# Altium schematic sheet Ventilator.SchDoc
size A3
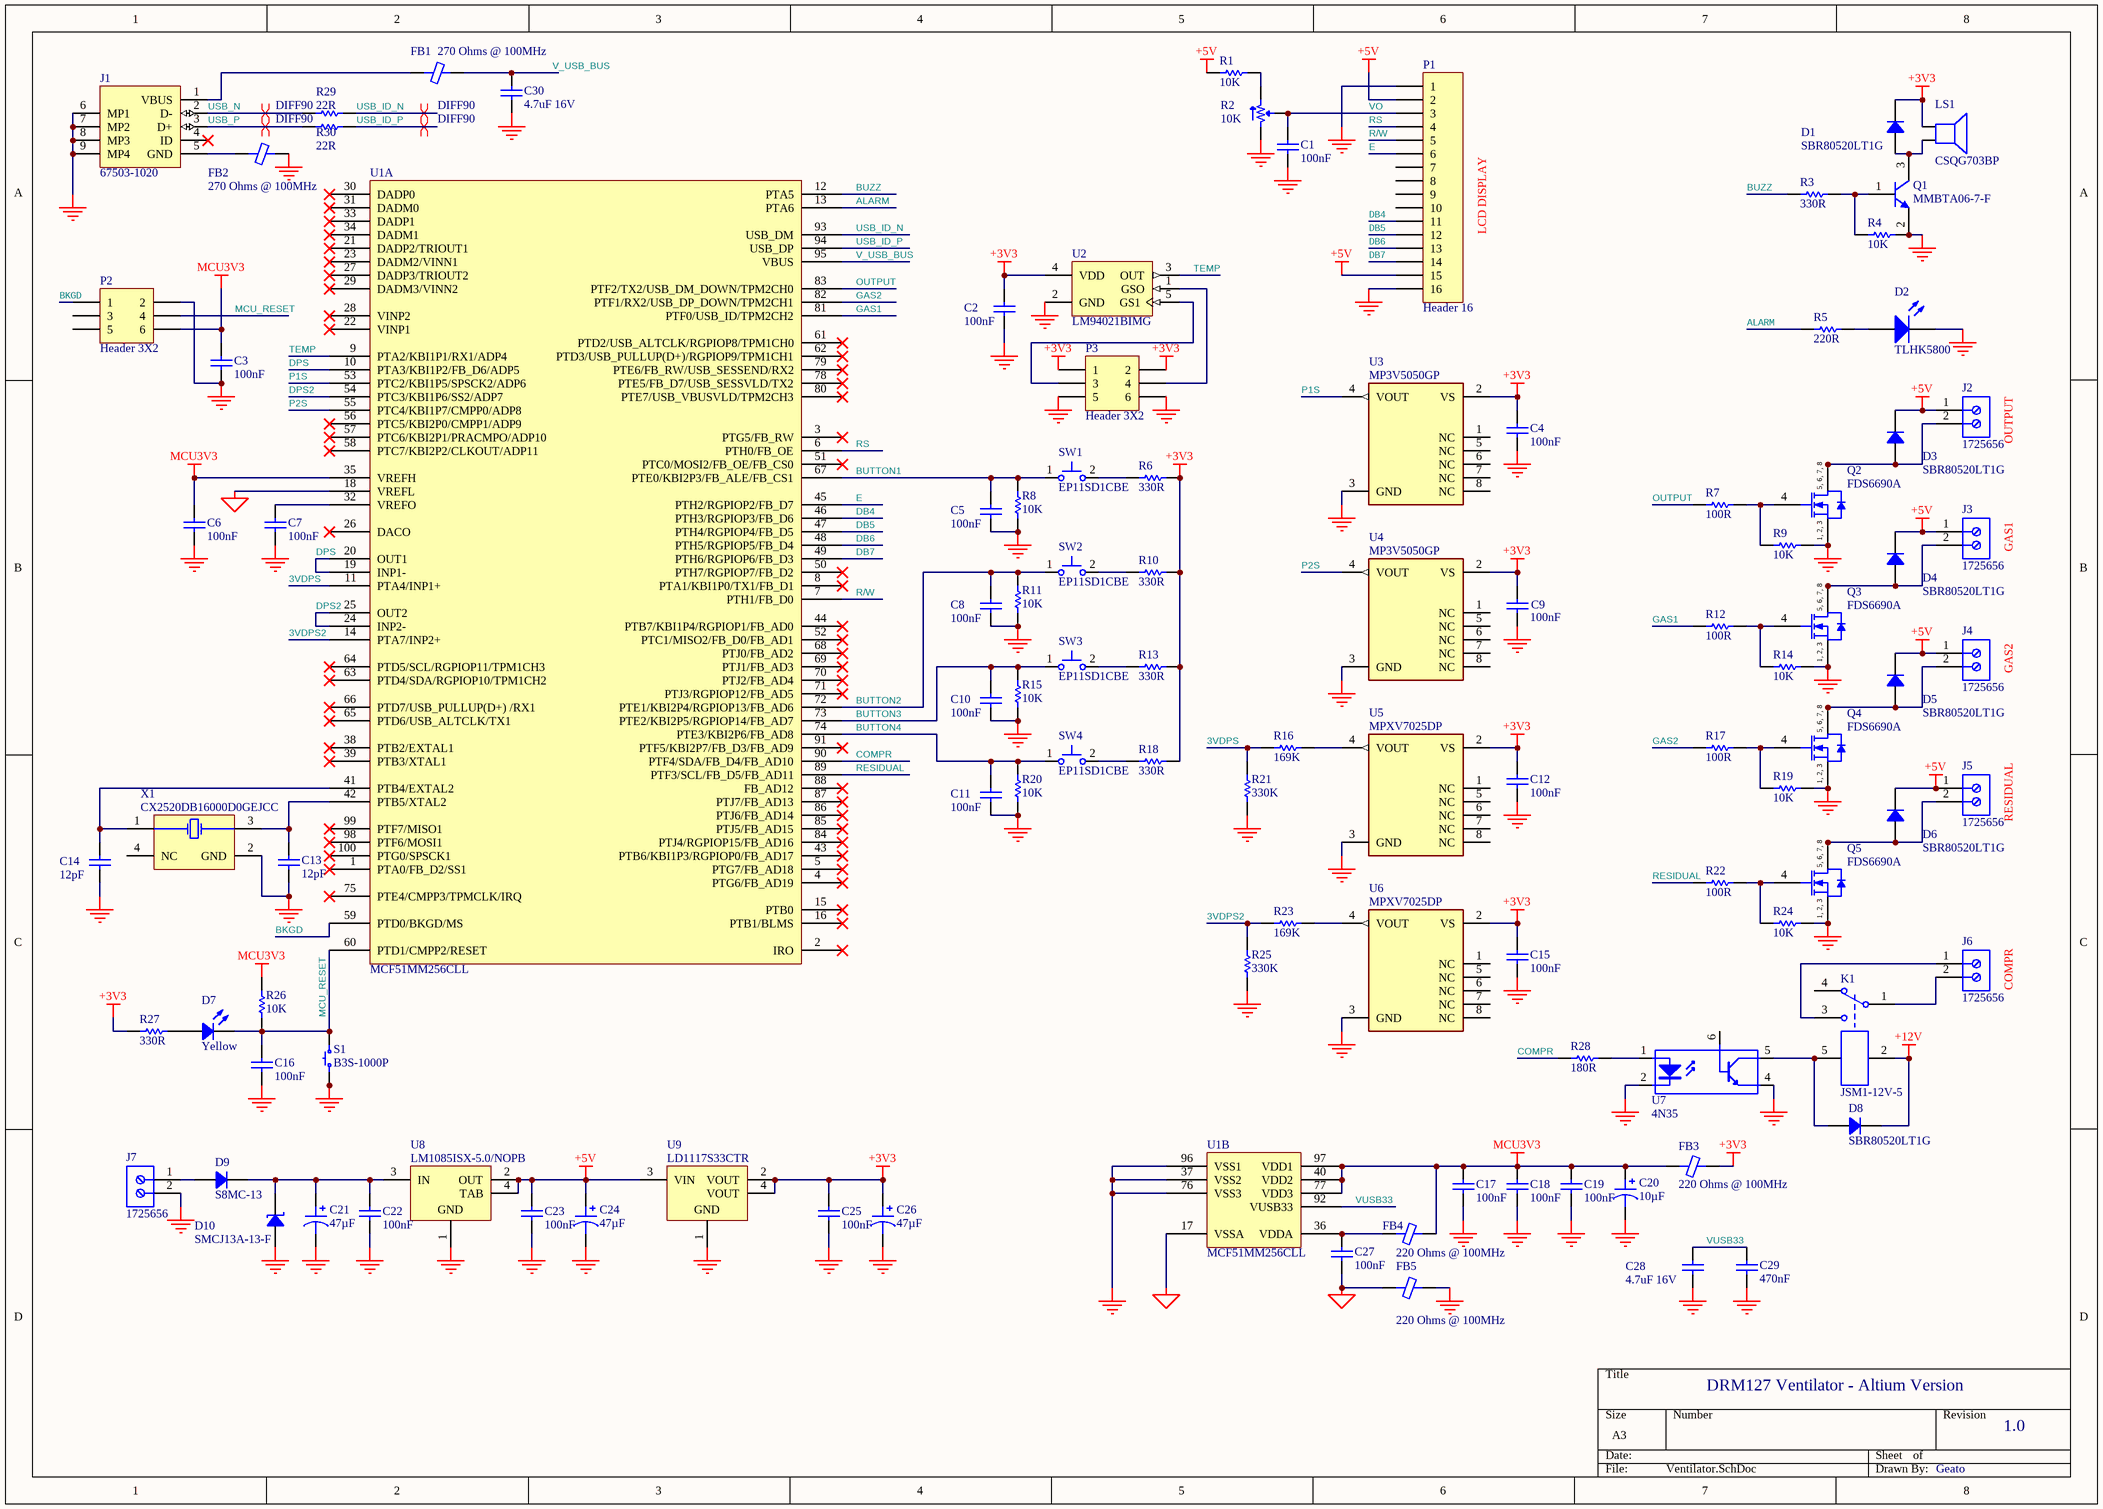
[diagram p0: Ventilator.SchDoc]

## Parts
C1  100nF  [CAPC0603(1608)100_N]
C2  100nF  [CAPC0603(1608)100_N]
C3  100nF  [CAPC0603(1608)100_N]
C4  100nF  [CAPC0603(1608)100_N]
C5  100nF  [CAPC0603(1608)100_N]
C6  100nF  [CAPC0603(1608)100_N]
C7  100nF  [CAPC0603(1608)100_N]
C8  100nF  [CAPC0603(1608)100_N]
C9  100nF  [CAPC0603(1608)100_N]
C10  100nF  [CAPC0603(1608)100_N]
C11  100nF  [CAPC0603(1608)100_N]
C12  100nF  [CAPC0603(1608)100_N]
C13  12pF  [CAPC0603(1608)100_N]
C14  12pF  [CAPC0603(1608)100_N]
C15  100nF  [CAPC0603(1608)100_N]
C16  100nF  [CAPC0603(1608)100_N]
C17  100nF  [CAPC0603(1608)100_N]
C18  100nF  [CAPC0603(1608)100_N]
C19  100nF  [CAPC0603(1608)100_N]
C20  10µF  [CAP ALSMD 5.3MM H5.4MM]
C21  47µF  [CAP ALSMD 6.6MM H6.1MM]
C22  100nF  [CAPC0603(1608)100_N]
C23  100nF  [CAPC0603(1608)100_N]
C24  47µF  [CAP ALSMD 6.6MM H6.1MM]
C25  100nF  [CAPC0603(1608)100_N]
C26  47µF  [CAP ALSMD 6.6MM H6.1MM]
C27  100nF  [CAPC0603(1608)100_N]
C28  4.7uF 16V  [CAPC0805(2012)145_N]
C29  470nF  [CAPC0805(2012)145_N]
C30  4.7uF 16V  [CAPC0805(2012)145_N]
D1  SBR80520LT1G  [SOD-123]
D2  TLHK5800  [LED T-13/4]
D3  SBR80520LT1G  [SOD-123]
D4  SBR80520LT1G  [SOD-123]
D5  SBR80520LT1G  [SOD-123]
D6  SBR80520LT1G  [SOD-123]
D7  Yellow  [LED 0603_1608 YELLOW]
D8  SBR80520LT1G  [SOD-123]
D9  S8MC-13  [DO214AB SMC]
D10  SMCJ13A-13-F  [DO214AB SMC]
FB1  270 Ohms @ 100MHz  [FER 0603_1608]
FB2  270 Ohms @ 100MHz  [FER 0603_1608]
FB3  220 Ohms @ 100MHz  [FER 0805_2012]
FB4  220 Ohms @ 100MHz  [FER 0805_2012]
FB5  220 Ohms @ 100MHz  [FER 0805_2012]
J1  67503-1020  [MOLX-67503-1020_V]
J2  1725656  [PHOE-1725656-2]
J3  1725656  [PHOE-1725656-2]
J4  1725656  [PHOE-1725656-2]
J5  1725656  [PHOE-1725656-2]
J6  1725656  [PHOE-1725656-2]
J7  1725656  [PHOE-1725656-2]
K1  JSM1-12V-5  [PNSC-JSM1-12V-5_V]
LS1  CSQG703BP  [CSQG703BP]
P1  Header 16  [NHD-0420DZ-FSW-FBW]
P2  Header 3X2  [HDR2X3]
P3  Header 3X2  [HDR2X3]
Q1  MMBTA06-7-F  [DIOD-SOT23-3_V]
Q2  FDS6690A  [FAIR-SOIC-8_V]
Q3  FDS6690A  [FAIR-SOIC-8_V]
Q4  FDS6690A  [FAIR-SOIC-8_V]
Q5  FDS6690A  [FAIR-SOIC-8_V]
R1  10K  [RESC0603(1608)_N]
R2  10K  [POT BOURNS TRIMPOT TC33]
R3  330R  [RESC0603(1608)_N]
R4  10K  [RESC0603(1608)_N]
R5  220R  [RESC0603(1608)_N]
R6  330R  [RESC0603(1608)_N]
R7  100R  [RESC0603(1608)_N]
R8  10K  [RESC0603(1608)_N]
R9  10K  [RESC0603(1608)_N]
R10  330R  [RESC0603(1608)_N]
R11  10K  [RESC0603(1608)_N]
R12  100R  [RESC0603(1608)_N]
R13  330R  [RESC0603(1608)_N]
R14  10K  [RESC0603(1608)_N]
R15  10K  [RESC0603(1608)_N]
R16  169K  [RESC0603(1608)_N]
R17  100R  [RESC0603(1608)_N]
R18  330R  [RESC0603(1608)_N]
R19  10K  [RESC0603(1608)_N]
R20  10K  [RESC0603(1608)_N]
R21  330K  [RESC0603(1608)_N]
R22  100R  [RESC0603(1608)_N]
R23  169K  [RESC0603(1608)_N]
R24  10K  [RESC0603(1608)_N]
R25  330K  [RESC0603(1608)_N]
R26  10K  [RESC0603(1608)_N]
R27  330R  [RESC0603(1608)_N]
R28  180R  [RESC0603(1608)_N]
R29  22R  [RESC0603(1608)_N]
R30  22R  [RESC0603(1608)_N]
S1  B3S-1000P  [OMRON B3S-1000P]
SW1  EP11SD1CBE  [EP11SD1CBE]
SW2  EP11SD1CBE  [EP11SD1CBE]
SW3  EP11SD1CBE  [EP11SD1CBE]
SW4  EP11SD1CBE  [EP11SD1CBE]
U1  MCF51MM256CLL  [TSQFP50P1600X1600X140-100N]  (parts A,B of 2)
U2  LM94021BIMG  [DCK0005A_N]
U3  MP3V5050GP  [NXP_Semiconductor_98ASA99303D_MFG]
U4  MP3V5050GP  [NXP_Semiconductor_98ASA99303D_MFG]
U5  MPXV7025DP  [MPXVxxxxDP]
U6  MPXV7025DP  [MPXVxxxxDP]
U7  4N35  [SMD-6]
U8  LM1085ISX-5.0/NOPB  [KTT0003B_N]
U9  LD1117S33CTR  [SOT-223_N]
X1  CX2520DB16000D0GEJCC  [AVX-CX2520DB_V]

## Nets
+3V3: C2.1 C4.1 C9.1 C12.1 C15.1 C25.1 C26.1 D1.2 FB3.1 LS1.1 P3.1 P3.2 R6.2 R10.2 R13.2 R18.2 R27.1 U2.4(VDD) U3.2(VS) U4.2(VS) U5.2(VS) U6.2(VS) U9.2(VOUT) U9.4(VOUT)
+5V: C23.1 C24.1 D3.2 D4.2 D5.2 D6.2 J2.1 J3.1 J4.1 J5.1 P1.2 P1.15 R1.1 U8.2(OUT) U8.4(TAB) U9.3(VIN)
+12V: D8.2 K1.2
AGND: C27.2 FB5.1 U1.17(VSSA) U1.18(VREFL)
GND: C1.2 C2.2 C3.2 C4.2 C5.2 C6.2 C7.2 C8.2 C9.2 C10.2 C11.2 C12.2 C13.2 C14.2 C15.2 C16.2 C17.2 C18.2 C19.2 C20.2 C21.2 C22.2 C23.2 C24.2 C25.2 C26.2 C28.1 C29.1 C30.1 D2.2(K) D10.1 FB2.2 FB5.2 J1.6(MP1) J1.7(MP2) J1.8(MP3) J1.9(MP4) J7.2 P1.1 P1.16 P2.2 P3.5 P3.6 Q1.2(E) Q2.1(S) Q2.2(S) Q2.3(S) Q3.1(S) Q3.2(S) Q3.3(S) Q4.1(S) Q4.2(S) Q4.3(S) Q5.1(S) Q5.2(S) Q5.3(S) R2.1 R4.2 R8.1 R9.2 R11.1 R14.2 R15.1 R19.2 R20.1 R21.1 R24.2 R25.1 S1.1 S1.2 U1.37(VSS2) U1.76(VSS3) U1.96(VSS1) U2.2(GND) U3.3(GND) U4.3(GND) U5.3(GND) U6.3(GND) U7.2(K) U7.4(E) U8.1(GND) U9.1(GND) X1.2(GND)
MCU3V3: C3.1 C6.1 C17.1 C18.1 C19.1 C20.1 FB3.2 FB4.2 P2.6 R26.2 U1.35(VREFH) U1.40(VDD2) U1.77(VDD3) U1.97(VDD1)
3VDPS: R16.1 R21.2 U1.11(PTA4/INP1+)
3VDPS2: R23.1 R25.2 U1.14(PTA7/INP2+)
ALARM: R5.1 U1.13(PTA6)
BKGD: P2.1 U1.59(PTD0/BKGD/MS)
BUTTON1: C5.1 R8.2 SW1.1 U1.67(PTE0/KBI2P3/FB_ALE/FB_CS1)
BUTTON2: C8.1 R11.2 SW2.1 U1.72(PTE1/KBI2P4/RGPIOP13/FB_AD6)
BUTTON3: C10.1 R15.2 SW3.1 U1.73(PTE2/KBI2P5/RGPIOP14/FB_AD7)
BUTTON4: C11.1 R20.2 SW4.1 U1.74(PTE3/KBI2P6/FB_AD8)
BUZZ: R3.1 U1.12(PTA5)
COMPR: R28.1 U1.90(PTF4/SDA/FB_D4/FB_AD10)
DB4: P1.11 U1.46(PTH3/RGPIOP3/FB_D6)
DB5: P1.12 U1.47(PTH4/RGPIOP4/FB_D5)
DB6: P1.13 U1.48(PTH5/RGPIOP5/FB_D4)
DB7: P1.14 U1.49(PTH6/RGPIOP6/FB_D3)
DPS: U1.10(PTA3/KBI1P2/FB_D6/ADP5) U1.19(INP1-) U1.20(OUT1)
DPS2: U1.24(INP2-) U1.25(OUT2) U1.54(PTC3/KBI1P6/SS2/ADP7)
E: P1.6 U1.45(PTH2/RGPIOP2/FB_D7)
GAS1: R12.1 U1.81(PTF0/USB_ID/TPM2CH2)
GAS2: R17.1 U1.82(PTF1/RX2/USB_DP_DOWN/TPM2CH1)
MCU_RESET: C16.1 D7.2 P2.4 R26.1 S1.3 S1.4 U1.60(PTD1/CMPP2/RESET)
OUTPUT: R7.1 U1.83(PTF2/TX2/USB_DM_DOWN/TPM2CH0)
P1S: U1.53(PTC2/KBI1P5/SPSCK2/ADP6) U3.4(VOUT)
P2S: U1.55(PTC4/KBI1P7/CMPP0/ADP8) U4.4(VOUT)
R/W: P1.5 U1.7(PTH1/FB_D0)
RESIDUAL: R22.1 U1.89(PTF3/SCL/FB_D5/FB_AD11)
RS: P1.4 U1.6(PTH0/FB_OE)
TEMP: U1.9(PTA2/KBI1P1/RX1/ADP4) U2.3(OUT)
USB_ID_N: R29.2 U1.93(USB_DM)
USB_ID_P: R30.2 U1.94(USB_DP)
USB_N: J1.2(D-) R29.1
USB_P: J1.3(D+) R30.1
V_USB_BUS: C30.2 FB1.2 U1.95(VBUS)
VO: C1.1 P1.3 R2.2
VUSB33: C28.2 C29.2 U1.92(VUSB33)
NetC7_1: C7.1 U1.32(VREFO)
NetC13_1: C13.1 U1.42(PTB5/XTAL2) X1.3(HOT)
NetC14_1: C14.1 U1.41(PTB4/EXTAL2) X1.1(HOT)
NetC21_1: C21.1 C22.1 D9.2 D10.2 U8.3(IN)
NetC27_1: C27.1 FB4.1 U1.36(VDDA)
NetD1_1: D1.1 LS1.2 Q1.3(C)
NetD2_1: D2.1(A) R5.2
NetD3_1: D3.1 J2.2 Q2.5(D) Q2.6(D) Q2.7(D) Q2.8(D)
NetD4_1: D4.1 J3.2 Q3.5(D) Q3.6(D) Q3.7(D) Q3.8(D)
NetD5_1: D5.1 J4.2 Q4.5(D) Q4.6(D) Q4.7(D) Q4.8(D)
NetD6_1: D6.1 J5.2 Q5.5(D) Q5.6(D) Q5.7(D) Q5.8(D)
NetD7_1: D7.1 R27.2
NetD8_1: D8.1 K1.5 U7.5(C)
NetD9_1: D9.1 J7.1
NetFB1_1: FB1.1 J1.1(VBUS)
NetFB2_1: FB2.1 J1.5(GND)
NetJ6_1: J6.1 K1.3(N.O.)
NetJ6_2: J6.2 K1.1(COM)
NetP3_3: P3.3 U2.5(GS1)
NetP3_4: P3.4 U2.1(GSO)
NetQ1_1: Q1.1(B) R3.2 R4.1
NetQ2_4: Q2.4(G) R7.2 R9.1
NetQ3_4: Q3.4(G) R12.2 R14.1
NetQ4_4: Q4.4(G) R17.2 R19.1
NetQ5_4: Q5.4(G) R22.2 R24.1
NetR1_2: R1.2 R2.3
NetR6_1: R6.1 SW1.2
NetR10_1: R10.1 SW2.2
NetR13_1: R13.1 SW3.2
NetR16_2: R16.2 U5.4(VOUT)
NetR18_1: R18.1 SW4.2
NetR23_2: R23.2 U6.4(VOUT)
NetR28_2: R28.2 U7.1(A)

Not connected (* = marked no-connect by the designer): J1 4(ID)*; K1 4(N.C.); P1 7 8 9 10; P2 3 5; U1 1(PTA0/FB_D2/SS1)* 2(IRO)* 3(PTG5/FB_RW)* 4(PTG6/FB_AD19)* 5(PTG7/FB_AD18)* 8(PTA1/KBI1P0/TX1/FB_D1)* 15(PTB0)* 16(PTB1/BLMS)* 21(DADP2/TRIOUT1)* 22(VINP1)* 23(DADM2/VINN1)* 26(DACO)* 27(DADP3/TRIOUT2)* 28(VINP2)* 29(DADM3/VINN2)* 30(DADP0)* 31(DADM0)* 33(DADP1)* 34(DADM1)* 38(PTB2/EXTAL1)* 39(PTB3/XTAL1)* 43(PTB6/KBI1P3/RGPIOP0/FB_AD17)* 44(PTB7/KBI1P4/RGPIOP1/FB_AD0)* 50(PTH7/RGPIOP7/FB_D2)* 51(PTC0/MOSI2/FB_OE/FB_CS0)* 52(PTC1/MISO2/FB_D0/FB_AD1)* 56(PTC5/KBI2P0/CMPP1/ADP9)* 57(PTC6/KBI2P1/PRACMPO/ADP10)* 58(PTC7/KBI2P2/CLKOUT/ADP11)* 61(PTD2/USB_ALTCLK/RGPIOP8/TPM1CH0)* 62(PTD3/USB_PULLUP(D+)/RGPIOP9/TPM1CH1)* 63(PTD4/SDA/RGPIOP10/TPM1CH2)* 64(PTD5/SCL/RGPIOP11/TPM1CH3)* 65(PTD6/USB_ALTCLK/TX1)* 66(PTD7/USB_PULLUP(D+)_/RX1)* 68(PTJ0/FB_AD2)* 69(PTJ1/FB_AD3)* 70(PTJ2/FB_AD4)* 71(PTJ3/RGPIOP12/FB_AD5)* 75(PTE4/CMPP3/TPMCLK/IRQ)* 78(PTE5/FB_D7/USB_SESSVLD/TX2)* 79(PTE6/FB_RW/USB_SESSEND/RX2)* 80(PTE7/USB_VBUSVLD/TPM2CH3)* 84(PTJ4/RGPIOP15/FB_AD16)* 85(PTJ5/FB_AD15)* 86(PTJ6/FB_AD14)* 87(PTJ7/FB_AD13)* 88(FB_AD12)* 91(PTF5/KBI2P7/FB_D3/FB_AD9)* 98(PTF6/MOSI1)* 99(PTF7/MISO1)* 100(PTG0/SPSCK1)*; U3 1(NC) 5(NC) 6(NC) 7(NC) 8(NC); U4 1(NC) 5(NC) 6(NC) 7(NC) 8(NC); U5 1(NC) 5(NC) 6(NC) 7(NC) 8(NC); U6 1(NC) 5(NC) 6(NC) 7(NC) 8(NC); U7 6(B); X1 4(NC)

## Layout directives
differential pair; net class DIFF90: USB_ID_N, USB_ID_P, USB_N, USB_P

## Notes on the sheet
- LCD DISPLAY
- (near J2) OUTPUT
- (near J3) GAS1
- (near J4) GAS2
- (near J5) RESIDUAL
- (near J6) COMPR
- DRM127 Ventilator - Altium Version
- 1.0
- Geato
- (in symbol CMP-2000-06260-1) 5, 6, 7, 8; 1, 2, 3

## Library data of the parts
C1-C12 C15-C19 C22 C23 C25 C27 = CMP-1035-02592-1: CAP 100nF 50V ±10% 0603 (1608 Metric) Thickness 1mm SMD; Case-EIA: 0603; Case-Metric: 1608; Tolerance: Â±10%; Technology: SMT; Rated Voltage: 50 V; Max Thickness: 1 mm; Value: 100nF
C13 C14 = CMP-1035-00616-1: CAP 12pF 50V ±0.5pF 0603 (1608 Metric) Thickness 1mm SMD; Case-Metric: 1608; Tolerance: Â±0.5pF; Case-EIA: 0603; Rated Voltage: 50 V; Value: 12pF; Max Thickness: 1 mm; Technology: SMT
C20 = EEE-1EA100SR: CAP ALUM 10UF 20% 25V SMD; Manufacturer: Panasonic Electronic Components; Lifetime @ Temp.: 2000 Hrs @ 85°C; Polarization: Polar; Ripple Current @ High Frequency: 47.6mA @ 10kHz; Ripple Current @ Low Frequency: 28mA @ 120Hz; Surface Mount Land Size: 0.209" L x 0.209" W (5.30mm x 5.30mm); Part Number: EEE-1EA100SR; Applications: Automotive; Capacitance: 10µF; ComponentLink1Description: Datasheet; ComponentLink1URL: //media.digikey.com/pdf/Data%20Sheets/Panasonic%20Electronic%20Components/S_Series,Type_V_Rev2018.pdf; ComponentLink2Description: DigiKey Link; ComponentLink2URL: http://digikey.com/product-detail/en/panasonic-electronic-components/EEE-1EA100SR/PCE3894CT-ND/766270; Device Package: Radial, Can - SMD; Height - Seated (Max): 0.213" (5.40mm); LastUpdated: 21/01/2020 4:04:23 AM; Lifecycle Status: Active; Minimum Order: 1; Mounting Type: Surface Mount; Operating Temperature: -40°C ~ 85°C; Package / Case: Radial, Can - SMD; Packaging: TapeAndReel; PartId: 7831; Part Status: Active; Price: 0.07; Ratings: AEC-Q200; Series: S; Size / Dimension: 0.197" Dia (5.00mm); Supplier 1: DigiKey; Supplier Part Number 1: PCE3894CT-ND; Tolerance: ±20%; Value: 10µF; Voltage - Rated: 25V
C21 C24 C26 = UWT1V470MCL1GS: CAP ALUM 47UF 20% 35V SMD; Manufacturer: Nichicon; Lifetime @ Temp.: 1000 Hrs @ 105°C; Polarization: Polar; Ripple Current @ High Frequency: 94.5mA @ 10kHz; Ripple Current @ Low Frequency: 63mA @ 120Hz; Surface Mount Land Size: 0.260" L x 0.260" W (6.60mm x 6.60mm); Part Number: UWT1V470MCL1GS; Applications: General Purpose; Capacitance: 47µF; ComponentLink1Description: Datasheet; ComponentLink1URL: https://products.nichicon.co.jp/en/pdf/XJA043/e-uwt.pdf; ComponentLink2Description: DigiKey Link; ComponentLink2URL: http://digikey.com/product-detail/en/nichicon/UWT1V470MCL1GS/493-2202-1-ND/590177; Device Package: Radial, Can - SMD; Height - Seated (Max): 0.228" (5.80mm); LastUpdated: 21/01/2020 2:33:38 AM; Lifecycle Status: Active; Minimum Order: 1; Mounting Type: Surface Mount; Operating Temperature: -55°C ~ 105°C; Package / Case: Radial, Can - SMD; Packaging: TapeAndReel; PartId: 8901; Part Status: Active; Price: 0.09; Series: UWT; Size / Dimension: 0.248" Dia (6.30mm); Supplier 1: DigiKey; Supplier Part Number 1: 493-2202-1-ND; Tolerance: ±20%; Value: 47µF; Voltage - Rated: 35V
C28 C30 = CMP-1036-04891-1: CAP 4.7uF 16V ±20% 0805 (2012 Metric) Thickness 1.45mm SMD; Case-Metric: 2012; Case-EIA: 0805; Tolerance: Â±20%; Value: 4.7uF; Max Thickness: 1.45 mm; Rated Voltage: 16 V; Technology: SMT
C29 = CMP-1036-04654-1: CAP 470nF 50V ±10% 0805 (2012 Metric) Thickness 1.45mm SMD; Case-EIA: 0805; Case-Metric: 2012; Tolerance: Â±10%; Value: 470nF; Rated Voltage: 50 V; Max Thickness: 1.45 mm; Technology: SMT
D1 D3-D6 D8 = SBR80520LT1G: DIODE SCHOTTKY 20V 500MA SOD123; Manufacturer: ON Semiconductor; Current - Reverse Leakage @ Vr: 250µA @ 20V; Speed: Fast Recovery =< 500ns, > 200mA (Io); Voltage - Forward (Vf) (Max) @ If: 385mV @ 500mA; Part Number: SBR80520LT1G; ComponentLink1Description: Datasheet; ComponentLink1URL: http://www.onsemi.com/pub/Collateral/MBR0520LT1-D.PDF; ComponentLink2Description: DigiKey Link; ComponentLink2URL: http://digikey.com/product-detail/en/on-semiconductor/SBR80520LT1G/SBR80520LT1GOSCT-ND/5969271; Current - Average Rectified (Io): 500mA; Device Package: SOD-123; Diode Type: Schottky; LastUpdated: 21/01/2020 2:42:33 AM; Lifecycle Status: Active; Minimum Order: 1; Mounting Type: Surface Mount; Operating Temperature - Junction: -65°C ~ 125°C; Package / Case: SOD-123; Packaging: TapeAndReel; PartId: 2307; Part Status: Active; Price: 0.14; Series: -; Supplier 1: DigiKey; Supplier Part Number 1: SBR80520LT1GOSCT-ND; Supplier Device Package: SOD-123; Voltage - DC Reverse (Vr) (Max): 20V
D2 = LED0: T-13/4 LED; Published: 8-Jun-2000; LatestRevisionDate: 08-Jul-2005; LatestRevisionNote: Mech Layer 1 removed.; PackageReference: LED-0; Publisher: Altium Limited; PackageDescription: LED; 2 Leads
D7 = 5975223407F: LED YELLOW DIFFUSED 0603 SMD; Manufacturer: Dialight; Configuration: Standard; Current - Test: 20mA; Lens Color: White; Lens Size: 1.10mm x 0.80mm; Lens Style: Rectangle with Flat Top; Millicandela Rating: 65mcd; Viewing Angle: 152°; Voltage - Forward (Vf) (Typ): 1.9V; Wavelength - Dominant: 590nm; Wavelength - Peak: 592nm; Part Number: 5975223407F; Color: Yellow; ComponentLink1Description: Datasheet; ComponentLink1URL: http://www.dialightsignalsandcomponents.com/Assets/Brochures_And_Catalogs/Indication/597-xxxx-4xx.pdf; ComponentLink2Description: DigiKey Link; ComponentLink2URL: http://digikey.com/product-detail/en/dialight/5975223407F/350-3032-1-ND/4079751; Device Package: 0603 (1608 Metric); Height (Max): 0.70mm; LastUpdated: 21/01/2020 3:14:59 AM; Lens Transparency: Diffused; Lifecycle Status: Active; Minimum Order: 1; Mounting Type: Surface Mount; Package / Case: 0603 (1608 Metric); Packaging: TapeAndReel; PartId: 160; Part Status: Active; Price: 0.69; Series: 597; Size / Dimension: 1.60mm L x 0.80mm W; Supplier 1: DigiKey; Supplier Part Number 1: 350-3032-1-ND; Supplier Device Package: 0603; Value: Yellow
D9 = S8MC-13: DIODE GEN PURP 1KV 8A SMC; Manufacturer: Diodes Incorporated; Capacitance @ Vr, F: 40pF @ 4V, 1MHz; Current - Reverse Leakage @ Vr: 10µA @ 1000V; Diode Type: Standard; Speed: Standard Recovery >500ns, > 200mA (Io); Voltage - DC Reverse (Vr) (Max): 1000V; Voltage - Forward (Vf) (Max) @ If: 985mV @ 8A; Part Number: S8MC-13; ComponentLink1Description: Datasheet; ComponentLink1URL: https://www.diodes.com/assets/Datasheets/ds31117.pdf; ComponentLink2Description: DigiKey Link; ComponentLink2URL: http://digikey.com/product-detail/en/diodes-incorporated/S8MC-13/S8MCDICT-ND/1774332; Current - Average Rectified (Io): 8A; Device Package: DO-214AB, SMC; LastUpdated: 21/01/2020 2:38:56 AM; Lifecycle Status: Active; Minimum Order: 1; Mounting Type: Surface Mount; Operating Temperature - Junction: -65°C ~ 150°C; Package / Case: DO-214AB, SMC; Packaging: TapeAndReel; PartId: 486; Part Status: Active; Price: 0.24; Series: -; Supplier 1: DigiKey; Supplier Part Number 1: S8MCDICT-ND; Supplier Device Package: SMC
D10 = SMCJ13A-13-F: TVS DIODE 13V 21.5V SMC; Manufacturer: Diodes Incorporated; Current - Peak Pulse (10/1000µs): 69.7A; Power Line Protection: No; Power - Peak Pulse: 1500W (1.5kW); Type: Zener; Unidirectional Channels: 1; Voltage - Breakdown (Min): 14.4V; Part Number: SMCJ13A-13-F; Applications: General Purpose; ComponentLink1Description: Datasheet; ComponentLink1URL: https://www.diodes.com/assets/Datasheets/ds19003.pdf; ComponentLink2Description: DigiKey Link; ComponentLink2URL: http://digikey.com/product-detail/en/diodes-incorporated/SMCJ13A-13-F/SMCJ13A-13-FDICT-ND/775878; Device Package: DO-214AB, SMC; LastUpdated: 21/03/2020 12:57:04 AM; Lifecycle Status: Active; Minimum Order: 1; Mounting Type: Surface Mount; Operating Temperature: -55°C ~ 150°C (TJ); Package / Case: DO-214AB, SMC; Packaging: TapeAndReel; PartId: 6904; Part Status: Active; Price: 0.27; Series: -; Supplier 1: DigiKey; Supplier Part Number 1: SMCJ13A-13-FDICT-ND; Supplier Device Package: SMC; Voltage - Clamping (Max) @ Ipp: 21.5V; Voltage - Reverse Standoff (Typ): 13V
FB1 FB2 = BKP1608HS271-T: FERRITE BEAD 270 OHM 0603 1LN; Manufacturer: Taiyo Yuden; Current Rating (Max): 1.2A; DC Resistance (DCR) (Max): 110mOhm; Filter Type: Power Line; Number of Lines: 1; Part Number: BKP1608HS271-T; ComponentLink1Description: Datasheet; ComponentLink1URL: https://ds.yuden.co.jp/TYCOMPAS/ut/detail?pn=BKP1608HS271-T  &u=M; ComponentLink2Description: DigiKey Link; ComponentLink2URL: http://digikey.com/product-detail/en/taiyo-yuden/BKP1608HS271-T/587-1925-1-ND/1465395; Device Package: 0603 (1608 Metric); Height (Max): 0.037" (0.95mm); Impedance @ Frequency: 270 Ohms @ 100MHz; LastUpdated: 21/01/2020 2:27:55 AM; Lifecycle Status: Active; Minimum Order: 1; Mounting Type: Surface Mount; Operating Temperature: -55°C ~ 85°C; Package / Case: 0603 (1608 Metric); Packaging: TapeAndReel; PartId: 1028; Part Status: Active; Price: 0.02; Series: BK; Size / Dimension: 0.063" L x 0.032" W (1.60mm x 0.80mm); Supplier 1: DigiKey; Supplier Part Number 1: 587-1925-1-ND; Value: 270 Ohms @ 100MHz
FB3-FB5 = BLM21PG221SN1D: FERRITE BEAD 220 OHM 0805 1LN; Manufacturer: Murata Electronics; Current Rating (Max): 2A; DC Resistance (DCR) (Max): 45mOhm; Filter Type: Power Line; Number of Lines: 1; Part Number: BLM21PG221SN1D; ComponentLink1Description: Datasheet; ComponentLink1URL: https://www.murata.com/en-us/products/en-us/products/productdata/8796738977822/ENFA0005.pdf; ComponentLink2Description: DigiKey Link; ComponentLink2URL: http://digikey.com/product-detail/en/murata-electronics/BLM21PG221SN1D/490-1054-1-ND/574418; Device Package: 0805 (2012 Metric); Height (Max): 0.041" (1.05mm); Impedance @ Frequency: 220 Ohms @ 100MHz; LastUpdated: 21/01/2020 2:29:16 AM; Lifecycle Status: Active; Minimum Order: 1; Mounting Type: Surface Mount; Operating Temperature: -55°C ~ 125°C; Package / Case: 0805 (2012 Metric); Packaging: TapeAndReel; PartId: 1360; Part Status: Active; Price: 0.02; Series: EMIFIL®, BLM21; Size / Dimension: 0.079" L x 0.049" W (2.00mm x 1.25mm); Supplier 1: DigiKey; Supplier Part Number 1: 490-1054-1-ND; Value: 220 Ohms @ 100MHz
J1 = CMP-0411-00002-1: USB, MINI, SMD, RA KME04-USBMU03A01; Manufacturer: Molex; ComponentLink1URL: http://www.molex.com/; PartNumber: 67503-1020; Mounting Technology: Surface Mount; ComponentLink1Description: Manufacturer URL; Terminal Pitch: 0.8 mm; DatasheetVersion: Rev F, 06/2009; ComponentLink2Description: Datasheet; PackageDescription: Mini USB Connector, SMT, Righer Angle; ComponentLink2URL: http://www.molex.com/pdm_docs/sd/675031020_sd.pdf; PackageReference: 67503-1020
J2-J7 = CMP-2000-05299-1: Male Header, Pitch 2.54 mm, 1 x 2 Position, Height 9 mm, Tail Length 3.5 mm; Manufacturer: Phoenix Contact; Number of contacts: 2; Content: 250pc(s); Pitch: 2.54mm; Industrial packaging: Yes; Colour: Green; Manufacturer part No.: 1725656; Type: MPT0,5/2-2,54; Datasheet URL: http://datasheet.octopart.com/1725656-Phoenix-Contact-datasheet-5302866.pdf; Manufacturer URL: http://www.phoenixcontact.com/; Datasheet Version: Apr-08
K1 = CMP-2000-06504-1: Global Standard Terminal Pitch Automotive Power Relay, SPDT, 12 VDC, -40 to 85 degC, 5-Pin THD, RoHS, Bulk; Manufacturer: Panasonic; Approval Bodies: CSA/TUV/UL; Switch Current Max: 10A; Coil Current: 53.3mA; Contact Current Max: 15A; DC Coil Power: 640mW; SVHC: NoSVHC(19-Dec-2012); Release Time: 10ms; No. of Poles: 1; Coil Operating Lower Percent Limit: 53%; Coil Resistance: 225ohm; Coil Voltage VDC Nom: 12V; PCB Hole Diameter: 1.3mm; External Length / Height: 22mm; Contact Voltage DC Max: 16V; Coil Operating Upper Percent Limit: 133%; Relay Mounting: ThroughHole; External Width: 16.4mm; Coil Type: DC; External Depth: 16mm; Mounting Technology: ThroughHole; Series: JS-M; Operating Temperature Max: 85°C; Contact Current AC Max: 15A; Contact Configuration: SPDT; Manufacturer URL: http://www.panasonic.com/; Package Reference: JSM1-12V-5; Relay Type: Power; Mounting Type: PCB; Nom Operating Power: 640mW; Package Description: 5-Pin Throuhe Hole Device, Body 22 x 16 mm; Contact Current Min: 15A; Operating Temperature Min: -40°C; Operating Time: 10ms; Contact Current DC Max: 15A; Contact Material: SilverAlloy; Datasheet URL: https://datasheet.ciiva.com/14146/pxjs-m-relays-data-e-14146481.pdf; Switching Current Max: 10A; Contact Voltage DC Nom: 16V; External Height: 22mm; Datasheet Version: 05/2007
LS1 = Speaker: Loudspeaker; Published: 24-Mar-1999; LatestRevisionDate: 17-Jul-2002; LatestRevisionNote: Re-released for DXP Platform.; PackageReference: PIN2; Publisher: Altium Limited; Supplier 1: Digi-Key; Supplier Part Number 1: 102-1286-ND
P1 = Header 16: Header, 16-Pin; LatestRevisionDate: 17-Jul-2002; LatestRevisionNote: Re-released for DXP Platform.; Publisher: Altium Limited
P2 P3 = Header 3X2: Header, 3-Pin, Dual row; LatestRevisionDate: 17-Jul-2002; LatestRevisionNote: Re-released for DXP Platform.; Publisher: Altium Limited
Q1 = CMP-2000-06733-1: NPN Small Signal Transistor, 80 V, -55 to 150 degC, 3-Pin SOT23, RoHS, Tape and Reel; Manufacturer: DiodesIncorporated; Maximum DC Collector Current: 0.5A; Pd - Power Dissipation: 300mW; Unit Weight: 0.000282oz; Emitter- Base Voltage VEBO: 4V; Collector- Emitter Voltage VCEO Max: 80V; Collector-Emitter Saturation Voltage: 0.25V; DC Collector/Base Gain hfe Min: 100; Gain Bandwidth Product fT: 100MHz; Configuration: Single; Series: MMBTA06; Factory Pack Quantity: 3000; Mounting Style: SMD/SMT; Package Description: 3-Pin Small Outline Transistor, Body 2.9 x 1.3 mm, Pitch 0.96 mm; Mounting Technology: SurfaceMount; Brand: DiodesIncorporated; Collector- Base Voltage VCBO: 80V; Datasheet Version: Rev. 14-2, 11/2013; Width: 1.4mm; RoHS: True; Length: 3.05mm; Height: 1mm; Package Reference: SOT23-3; Product Category: BipolarTransistors-BJT; Minimum Operating Temperature: -55C; Datasheet URL: http://www.diodes.com/_files/datasheets/ds30037.pdf; Package / Case: SOT-23; Maximum Operating Temperature: +150C; Transistor Polarity: NPN; Continuous Collector Current: 0.5A; Manufacturer URL: http://www.diodes.com/; Packaging: Reel
Q2-Q5 = CMP-2000-06260-1: Single N-Channel, Logic-Level, PowerTrench(R) MOSFET, 11 A, 30 V, -55 to 150 degC, 8-Pin SOIC (SO-8), RoHS, Tape and Reel; Manufacturer: Fairchild Semiconductor; Typical Turn-Off Delay Time: 28ns; Transistor Material: Si; Typical Turn-On Delay Time: 9ns; Channel Mode: Enhancement; Maximum Power Dissipation: 2.5W; Typical Input Capacitance @ Vds: 1205pF@15V; Maximum Continuous Drain Current: 11A; Maximum Gate Source Voltage: ±20V; Channel Type: N; Typical Gate Charge @ Vgs: 12nC@5V; Number of Elements per Chip: 1; Minimum Gate Threshold Voltage: 1V; Maximum Drain Source Resistance: 0.013Ω; Maximum Drain Source Voltage: 30V; Datasheet Version: Rev. E1, 02/2007; Length: 5mm; Category: PowerMOSFET; Mounting Type: SurfaceMount; Pin Count: 8; Minimum Operating Temperature: -55°C; Dimensions: 5x4x1.5mm; Package Type: SOIC; Width: 4mm; Datasheet URL: https://www.fairchildsemi.com/datasheets/FD/FDS6690A.pdf; Manufacturer URL: https://www.fairchildsemi.com/; Package URL: https://www.fairchildsemi.com/package-drawings/M0/M08A.pdf; Mounting Technology: SurfaceMount; Package Reference: SOIC-8; Maximum Operating Temperature: +150°C; Package Description: 8-Pin Small Outline Integrated Circuit, Body 4.9 x 3.9 mm, Pitch 1.27 mm; Transistor Configuration: Single; Height: 1.5mm
R1 R4 R8 R9 R11 R14 R15 R19 R20 R24 R26 = CMP-1012-00098-1: 10K 0.1W 5% 0603 (1608 Metric)  SMD; Case-EIA: 0603; Value: 10000.00 Ohm; Case-Metric: 1608; Technology: SMT; Tolerance: 5 %; Power: 0.1 W
R2 = TC33X-1-103E: TRIMMER 10K OHM 0.1W J LEAD TOP; Manufacturer: Bourns Inc.; Adjustment Type: Top Adjustment; Number of Turns: 1; Power (Watts): 0.1W, 1/10W; Resistance: 10 kOhms; Resistive Material: Cermet; Temperature Coefficient: ±250ppm/°C; Tolerance: ±25%; Part Number: TC33X-1-103E; ComponentLink1Description: Datasheet; ComponentLink1URL: https://www.bourns.com/docs/Product-Datasheets/TC33.pdf; ComponentLink2Description: DigiKey Link; ComponentLink2URL: http://digikey.com/product-detail/en/bourns-inc/TC33X-1-103E/TC33X-1-103ECT-ND/7244463; LastUpdated: 21/01/2020 3:20:18 AM; Lifecycle Status: Active; Minimum Order: 1; Mounting Type: Surface Mount; Packaging: TapeAndReel; PartId: 9; Part Status: Active; Price: 0.15; Series: Trimpot® TC33 - Open Frame; Size / Dimension: Rectangular - 0.150" x 0.142" Face x 0.047" H (3.80mm x 3.60mm x 1.20mm); Supplier 1: DigiKey; Supplier Part Number 1: TC33X-1-103ECT-ND; Termination Style: J Lead; Value: 10K
R3 R6 R10 R13 R18 R27 = CMP-1012-00062-1: 330R 0.1W 5% 0603 (1608 Metric)  SMD; Value: 330.00 Ohm; Case-EIA: 0603; Case-Metric: 1608; Tolerance: 5 %; Power: 0.1 W; Technology: SMT
R5 = CMP-1012-00058-1: 220R 0.1W 5% 0603 (1608 Metric)  SMD; Case-EIA: 0603; Case-Metric: 1608; Value: 220.00 Ohm; Technology: SMT; Power: 0.1 W; Tolerance: 5 %
R7 R12 R17 R22 = CMP-1012-00050-1: 100R 0.1W 5% 0603 (1608 Metric)  SMD; Case-EIA: 0603; Value: 100.00 Ohm; Case-Metric: 1608; Tolerance: 5 %; Technology: SMT; Power: 0.1 W
R16 R23 = CMP-1012-00760-1: 169K 0.1W 1% 0603 (1608 Metric)  SMD; Case-EIA: 0603; Case-Metric: 1608; Value: 169000.00 Ohm; Tolerance: 1 %; Technology: SMT; Power: 0.1 W
R21 R25 = CMP-1012-00793-1: 330K 0.1W 1% 0603 (1608 Metric)  SMD; Case-EIA: 0603; Case-Metric: 1608; Value: 330000.00 Ohm; Power: 0.1 W; Technology: SMT; Tolerance: 1 %
R28 = CMP-1012-00056-1: 180R 0.1W 5% 0603 (1608 Metric)  SMD; Value: 180.00 Ohm; Case-EIA: 0603; Case-Metric: 1608; Power: 0.1 W; Technology: SMT; Tolerance: 5 %
R29 R30 = CMP-1012-00034-1: 22R 0.1W 5% 0603 (1608 Metric)  SMD; Value: 22.00 Ohm; Case-EIA: 0603; Case-Metric: 1608; Technology: SMT; Power: 0.1 W; Tolerance: 5 %
S1 = B3S-1000P: SWITCH TACTILE SPST-NO 0.05A 24V; Manufacturer: Omron Electronics Inc-EMC Div; Actuator Height off PCB, Vertical: 4.30mm; Actuator Orientation: Top Actuated; Actuator Type: Standard; Contact Rating @ Voltage: 0.05A @ 24VDC; Illumination: Non-Illuminated; Ingress Protection: IP67 - Dust Tight, Waterproof; Operating Force: 160gf; Outline: 6.60mm x 6.00mm; Switch Function: Off-Mom; Part Number: B3S-1000P; Circuit: SPST-NO; ComponentLink1Description: Datasheet; ComponentLink1URL: https://omronfs.omron.com/en_US/ecb/products/pdf/en-b3s.pdf; ComponentLink2Description: DigiKey Link; ComponentLink2URL: http://digikey.com/product-detail/en/omron-electronics-inc-emc-div/B3S-1000P/SW836CT-ND/700012; Features: Sealed - Fully; LastUpdated: 31/01/2020 1:36:13 AM; Lifecycle Status: Active; Minimum Order: 1; Mounting Type: Surface Mount; Operating Temperature: -25°C ~ 70°C; Packaging: TapeAndReel; Part Status: Active; Price: 0.39; Series: B3S; Supplier 1: DigiKey; Supplier Part Number 1: SW836CT-ND; Termination Style: Gull Wing
SW1-SW4 = EP11SD1CBE: EP Series Sealed Pushbutton Switches; PCB_Layout: Complies with manufacturer's recommendation.; Published: 14-Mar-2008; DatasheetVersion: Aug-2007; PackageVersion: Aug-2007; PackageReference: KSS-2G; Publisher: Altium Limited; PackageDescription: Subminiature SMT Side Actuated Switch, Body 7 x 3.5 mm (LxW); ComponentLink1Description: Manufacturer Link; ComponentLink1URL: http://www.ck-components.com/; ComponentLink2Description: Datasheet; ComponentLink2URL: http://www.ck-components.com/media/pdf/catalogs/Tactile_Switches%5CKSS_series_Tactile_August_2007.pdf
U1 = MCF51MM256CLL: 32-bit Coldfire Freescale MCU; Supplier 1: Digi-Key; Supplier Part Number 1: 568-14492-ND
U2 = CMP-0066-00198-3: Multi-Gain Analog Temperature Sensor, 5-pin SC-70; Manufacturer: Texas Instruments; PowerWise: Y; PackageTopMarking: 21B*XTT; CompType: Temp Sensor IC; ComponentLink1URL: http://www.ti.com/general/docs/lit/getliterature.tsp?genericPartNumber=LM94021&fileType=pdf; Code_JEDEC: MO-203-AA; PackageDescription: Molded SC-70, 2 x 1.25 x .9mm, 5 Lead, 0.65mm Pitch; PackageReference: DCK0005A; RoHS: N; ComponentLink1Description: Datasheet URL; Code_IPC: SOT353-5; Code_JEITA: SC-88A; PinCount: 5
U5 U6 = MPXV7025DP: +/- 25 kPa Differential Pressure Sensor
U7 = Optoisolator: 6Pin Optocoupler; Published: 24-Mar-1999; LatestRevisionDate: 04-Mar-2005; LatestRevisionNote: PCB Footprint replaced, Sch pins re-numbered.; DatasheetVersion: Apr-2004; PackageReference: SOP5(6); Publisher: Altium Limited; PackageDescription: Small Outline; 6 Leads (1 Absent); Body Width 4.4 mm; Pitch 1.27 mm
U8 = CMP-0062-00617-5: 3A Low Dropout Positive Regulators, 3-pin TO-263, Pb-Free; Manufacturer: Texas Instruments; High-Reliability: Y; CompType: LDO IC; PowerWise: N; PackageTopMarking: NSUZXYTTE#*LM1085*IS-5.0; ComponentLink1URL: http://www.ti.com/general/docs/lit/getliterature.tsp?genericPartNumber=LM1085&fileType=pdf; PackageReference: KTT0003B; PinCount: 3; ComponentLink1Description: Datasheet URL; Code_JEDEC: MO-169-AA; RoHS: Y; PartNumber: LM1085ISX-5.0/NOPB; PackageDescription: TO-263, Molded, .400 x .390 x .180in, 3 Lead, .1in Pitch, Surface Mount
U9 = CMP-0244-00307-1: Fixed Low Drop Positive Voltage Regulator, 3.3V, 4-Pin SOT-223, Tape and Reel; ComponentLink1URL: http://www.st.com; PackageVersion: 2010; ComponentLink1Description: Manufacturer URL; DatasheetVersion: 1/11/2011; ComponentLink2URL: http://www.st.com/internet/com/TECHNICAL_RESOURCES/TECHNICAL_LITERATURE/DATASHEET/CD00000544.pdf; PackageReference: SOT-223; ComponentLink2Description: Datasheet; PackageDescription: 4-Pin SOT-223 Package, 6.5 x 3.5 mm Body, 2.3 mm Pitch, 7 mm Lead Span
X1 = CMP-2000-06128-1: Crystal, 16 MHz, 8 pF, -10 to 70 degC, 4-Pin SMD, RoHS, Tape and Reel; Manufacturer: AVX; ESR: 80Ohms; Frequency: 16MHz; Frequency Stability: 15PPM; Load Capacitance: 8pF; Unit Weight: 0.000459oz; Qualification: AEC-Q200; Drive Level: 10uW; Brand: AVX/Kyocera; Manufacturer URL: http://global.kyocera.com/; Factory Pack Quantity: 3000; Length: 2.5mm; Package Reference: CX2520DB; Product Category: Crystals; Width: 2mm; Mounting Technology: SurfaceMount; Packaging: Reel; Termination Style: SMD/SMT; Mounting Style: SMD/SMT; RoHS: True; Package Description: 4-Pin Surface Mount Device, Body 2.5 x 2 mm, Pitch 1.7 mm; Datasheet URL: http://www.kyocera-crystal.jp/eng/wp-content/uploads/2014/12/cx2520db_e.pdf; Datasheet Version: 09/2015; Package / Case: 2.5mmx2mm; Height: 0.5mm; Tolerance: 15PPM; Type: SMDCrystal; Series: CX2520DB; Operating Temperature Range: -10Cto+70C